# EAGLE design parksharks_board (EAGLE 9.6.2)
CNAME: MSP430FR5994 Sensor Board; CREVISION: 1; DESIGNER: Jacob Sorber
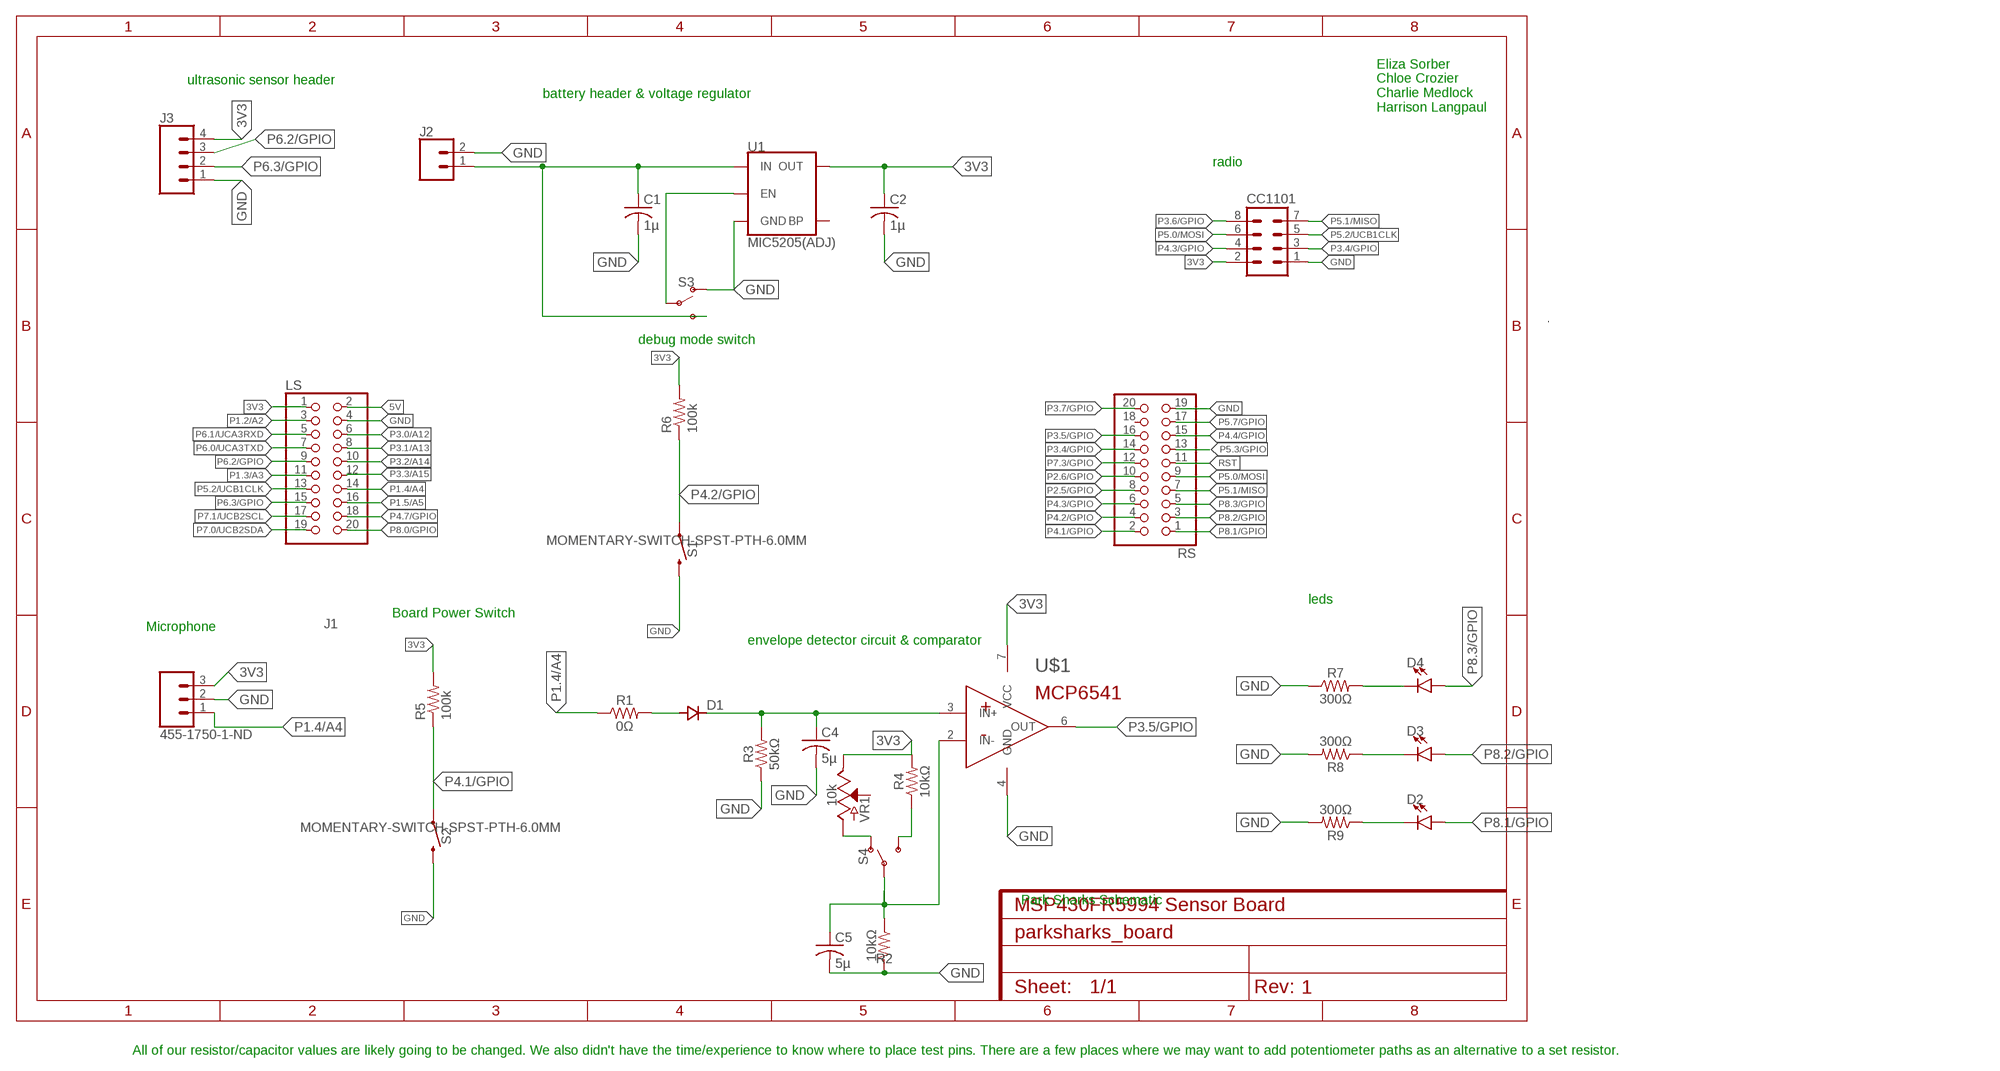
[diagram p0: schematic, sheet 1]

## Parts
C1  1µ  C-USC0805  [C0805]
C2  1µ  C-USC0805  [C0805]
C4  5µ  C-USC0805  [C0805]
C5  5µ  C-USC0805  [C0805]
CC1101  MA04-2  [MA04-2]
D1  DSOD323  [SOD323]
D2  LED5MM  [LED_5MM]
D3  LED5MM  [LED_5MM]
D4  LED5MM  [LED_5MM]
J1  455-1750-1-ND  CONN_03  [1X03]
J2  CONN_02  [1X02]
J3  CONN_04JST-PTH  [JST-4-PTH]
LS  PINHD-2X10  [2X10]
R1  0Ω  0.3OHM-0805-1/8W-1%  [0805]
R2  10kΩ  0.3OHM-0805-1/8W-1%  [0805]
R3  50kΩ  0.3OHM-0805-1/8W-1%  [0805]
R4  10kΩ  0.3OHM-0805-1/8W-1%  [0805]
R5  100k  R-US_R0805  [R0805]
R6  100k  R-US_R0805  [R0805]
R7  300Ω  0.3OHM-0805-1/8W-1%  [0805]
R8  300Ω  0.3OHM-0805-1/8W-1%  [0805]
R9  300Ω  0.3OHM-0805-1/8W-1%  [0805]
RS  PINHD-2X10  [2X10]
S1  MOMENTARY-SWITCH-SPST-PTH-6.0MM  [TACTILE_SWITCH_PTH_6.0MM]
S2  MOMENTARY-SWITCH-SPST-PTH-6.0MM  [TACTILE_SWITCH_PTH_6.0MM]
S3  SWITCH-SPDT-PTH-11.6X4.0MM  [SWITCH_SPDT_PTH_11.6X4.0MM]
S4  SWITCH-SPDT-PTH-11.6X4.0MM  [SWITCH_SPDT_PTH_11.6X4.0MM]
U1  MIC5205(ADJ)  V_REG_MIC5205ADJ  [SOT23-5]
U$1  MCP654!  [DIP08]
VR1  10k  POTENTIOMETER-PTH-9MM-1/20W-20%  [POT-PTH-ALPS]

## Nets
3V3: C2.1 CC1101.2 J1.3 J3.4 LS.1 R4.2 R5.2 R6.2 U1.5(OUT) U$1.7(VCC) VR1.P$1(E)
5V: LS.2
GND: C1.2 C2.2 C4.2 C5.2 CC1101.1 J1.2 J2.2 J3.1 LS.4 R2.2 R3.1 R7.1 R8.2 R9.2 RS.19 S1.3 S2.3 S3.1(O) U1.2(GND) U$1.4(GND)
N$1: D1.2(A) R1.2
N$2: C4.1 D1.1(C) R3.2 U$1.3(IN+)
N$3: C5.1 R2.1 S4.2(P) U$1.2(IN-)
N$4: S3.2(P) U1.3(EN)
N$5: S4.1(O) VR1.P$3(A)
N$6: R4.1 S4.3(S)
N$7: C1.1 J2.1 S3.3(S) U1.1(IN)
N$12: D4.K(C) R7.2
N$13: D3.K(C) R8.1
N$14: D2.K(C) R9.1
P1.2/A2: LS.3
P1.3/A3: LS.11
P1.4/A4: J1.1 LS.14 R1.1
P1.5/A5: LS.16
P2.5/GPIO: RS.8
P2.6/GPIO: RS.10
P3.0/A12: LS.6
P3.1/A13: LS.8
P3.2/A14: LS.10
P3.3/A15: LS.12
P3.4/GPIO: CC1101.3 RS.14
P3.5/GPIO: RS.16 U$1.6(OUT)
P3.6/GPIO: CC1101.8
P3.7/GPIO: RS.20
P4.1/GPIO: R5.1 RS.2 S2.1
P4.2/GPIO: R6.1 RS.4 S1.1
P4.3/GPIO: CC1101.4 RS.6
P4.4/GPIO: RS.15
P4.7/GPIO: LS.18
P5.0/MOSI: CC1101.6 RS.9
P5.1/MISO: CC1101.7 RS.7
P5.2/UCB1CLK: CC1101.5 LS.13
P5.3/GPIO: RS.13
P5.7/GPIO: RS.17
P6.0/UCA3TXD: LS.7
P6.1/UCA3RXD: LS.5
P6.2/GPIO: J3.3 LS.9
P6.3/GPIO: J3.2 LS.15
P7.0/UCB2SDA: LS.19
P7.1/UCB2SCL: LS.17
P7.3/GPIO: RS.12
P8.0/GPIO: LS.20
P8.1/GPIO: D2.A RS.1
P8.2/GPIO: D3.A RS.3
P8.3/GPIO: D4.A RS.5
RST: RS.11
Unconnected: RS.18 U1.4(BP) VR1.P$2(S)

## Notes on the sheet
- ultrasonic sensor header
- battery header & voltage regulator
- Eliza Sorber
  Chloe Crozier
  Charlie Medlock
  Harrison Langpaul
- radio
- debug mode switch
- leds
- Board Power Switch
- Microphone
- envelope detector circuit & comparator
- Park Sharks Schematic
- All of our resistor/capacitor values are likely going to be changed. We also didn't have the time/experience to know where to place test pins. There are a few places where we may want to add potentiometer paths as an alternative to a set resistor.

## Library data of the parts
C1 C2 C4 C5 = rcl:C-US: CAPACITOR, American symbol; SPICEPREFIX: C
CC1101 = con-lstb:MA04-2: PIN HEADER; OC_FARNELL: unknown; OC_NEWARK: unknown
D1 = zetex:D: DIODE; MPN: CDSOD323-T05C; OC_FARNELL: 1824860; OC_NEWARK: 79R6078
D2-D4 = SparkFun-LED:LED: LED (Generic) Standard schematic elements and footprints for 5mm, 3mm, 1206, and 0603 sized LEDs. Generic LEDs with no color specified.
J1 = SparkFun-Connectors:CONN_03: Multi connection point. Often used as Generic Header-pin footprint for 0.1 inch spaced/style header connections On any of the 0.1 inch spaced packages, you can populate with these: Break Away Headers - Straight <https://www.sparkfun.com/products/116> (PRT-00116) Break Away Male Headers - Right Angle <https://www.sparkfun.com/products/553> (PRT-00553) Female Headers <https://www.sparkfun.com/products/115> (PRT-00115) Break Away Headers - Machine Pin <https://www.sparkfun.com/products/117> (PRT-00117) Break Away Female Headers - Swiss Machine Pin <https://www.sparkfun.com/products/743> (PRT-00743) Stackable Header - 3 Pin (Female, 0.1") <https://www.sparkfun.com/products/13875> (PRT-13875) For SCREWTERMINALS and SPRING TERMINALS visit here: Screw Terimnals on SparkFun.com <https://www.sparkfun.com/search/results?term=Screw+Terminals> (5mm/3.5mm/2.54mm spacing) This device is also useful as a general connection point to wire up your design to another part of your project. Our various solder wires solder well into these plated through hole pads. Hook-Up Wire - Assortment (Stranded, 22 AWG) <https://www.sparkfun.com/products/11375> (PRT-11375) Hook-Up Wire - Assortment (Solid Core, 22 AWG) <https://www.sparkfun.com/products/11367> (PRT-11367) View the entire wire category on our website here <https://www.sparkfun.com/categories/141> Special notes: Molex polarized connector foot print use with SKU : PRT-08232 with associated crimp pins and housings.; PROD_ID: XXX-00000
J2 = SparkFun-Connectors:CONN_02: Multi connection point. Often used as Generic Header-pin footprint for 0.1 inch spaced/style header connections On any of the 0.1 inch spaced packages, you can populate with these: Break Away Headers - Straight <https://www.sparkfun.com/products/116> (PRT-00116) Break Away Male Headers - Right Angle <https://www.sparkfun.com/products/553> (PRT-00553) Female Headers <https://www.sparkfun.com/products/115> (PRT-00115) Break Away Headers - Machine Pin <https://www.sparkfun.com/products/117> (PRT-00117) Break Away Female Headers - Swiss Machine Pin <https://www.sparkfun.com/products/743> (PRT-00743) For SCREWTERMINALS and SPRING TERMINALS visit here: Screw Terimnals on SparkFun.com <https://www.sparkfun.com/search/results?term=Screw+Terminals> (5mm/3.5mm/2.54mm spacing) This device is also useful as a general connection point to wire up your design to another part of your project. Our various solder wires solder well into these plated through hole pads. Hook-Up Wire - Assortment (Stranded, 22 AWG) <https://www.sparkfun.com/products/11375> (PRT-11375) Hook-Up Wire - Assortment (Solid Core, 22 AWG) <https://www.sparkfun.com/products/11367> (PRT-11367) View the entire wire category on our website here <https://www.sparkfun.com/categories/141> Special notes: Molex polarized connector foot print use with: PRT-08233 with associated crimp pins and housings. 2.54_SCREWTERM for use with PRT-10571. 3.5mm Screw Terminal footprints for PRT-08084 5mm Screw Terminal footprints for use with PRT-08432
J3 = SparkFun-Connectors:CONN_04: Multi connection point. Often used as Generic Header-pin footprint for 0.1 inch spaced/style header connections On any of the 0.1 inch spaced packages, you can populate with these: Break Away Headers - Straight <https://www.sparkfun.com/products/116> (PRT-00116) Break Away Male Headers - Right Angle <https://www.sparkfun.com/products/553> (PRT-00553) Female Headers <https://www.sparkfun.com/products/115> (PRT-00115) Break Away Headers - Machine Pin <https://www.sparkfun.com/products/117> (PRT-00117) Break Away Female Headers - Swiss Machine Pin <https://www.sparkfun.com/products/743> (PRT-00743) For SCREWTERMINALS and SPRING TERMINALS visit here: Screw Terimnals on SparkFun.com <https://www.sparkfun.com/search/results?term=Screw+Terminals> (5mm/3.5mm/2.54mm spacing) This device is also useful as a general connection point to wire up your design to another part of your project. Our various solder wires solder well into these plated through hole pads. Hook-Up Wire - Assortment (Stranded, 22 AWG) <https://www.sparkfun.com/products/11375> (PRT-11375) Hook-Up Wire - Assortment (Solid Core, 22 AWG) <https://www.sparkfun.com/products/11367> (PRT-11367) View the entire wire category on our website here <https://www.sparkfun.com/categories/141> Special notes: Molex polarized connector foot print use with SKU : PRT-08231 with associated crimp pins and housings. 1MM SMD Version SKU: PRT-10208; PROD_ID: WIRE-13531; SF_ID: PRT-09916
LS RS = pinhead:PINHD-2X10: PIN HEADER
R1-R4 R7-R9 = SparkFun-Resistors:0.3OHM: 0.3Ω resistor A resistor is a passive two-terminal electrical component that implements electrical resistance as a circuit element. Resistors act to reduce current flow, and, at the same time, act to lower voltage levels within circuits. - Wikipedia; PROD_ID: RES-11622; VALUE: 0.3
R5 R6 = rcl:R-US_: RESISTOR, American symbol; SPICEPREFIX: R
S1 S2 = SparkFun-Switches:MOMENTARY-SWITCH-SPST: Momentary Switch (Pushbutton) - SPST Normally-open (NO) SPST momentary switches (buttons, pushbuttons). Variants PTH-12MM - 12mm square, through-hole Momentary Pushbutton Switch - 12mm Square <https://www.sparkfun.com/products/9190> (COM-09190) PTH-6.0MM, PTH-6.0MM-KIT - 6.0mm square, through-hole Mini Pushbutton Switch <https://www.sparkfun.com/products/97> (COM-00097) KIT package intended for soldering kit's - only one side of pads' copper is exposed. PTH-RIGHT-ANGLE-KIT - Right-angle, through-hole Right Angle Tactile Button <https://www.sparkfun.com/products/10791> - Used on SparkFun BigTime Watch Kit <https://www.sparkfun.com/products/11734> SMD-12MM - 12mm square, surface-mount Tactile Button - SMD (12mm) <https://www.sparkfun.com/products/12993> (COM-12993) Used on SparkFun PicoBoard <https://www.sparkfun.com/products/11888> SMD-4.5MM - 4.5mm Square Trackball Switch Used on SparkFun Blackberry Trackballer Breakout <https://www.sparkfun.com/products/13169> SMD-4.6MMX2.8MM - 4.60mm x 2.80mm, surface mount Used on SparkFun Pro Micro - RP2040 <https://www.sparkfun.com/products/17717> SMD-5.2MM, SMD-5.2-REDUNDANT - 5.2mm square, surface-mount Mini Pushbutton Switch - SMD <https://www.sparkfun.com/products/8720> (COM-08720) Used on Arduino Pro Mini <https://www.sparkfun.com/products/11114> REDUNDANT package connects both switch circuits together SMD-6.0X3.5MM - 6.0 x 3.5mm, surface mount Momentary Reset Switch SMD <https://www.sparkfun.com/products/8229> (COM-08229) SMD-6.2MM-TALL - 6.2mm square, surface mount Tactile Button - SMD (6mm) <https://www.sparkfun.com/products/12992> Used on SparkFun Digital Sandbox <https://www.sparkfun.com/products/12651> SMD-RIGHT-ANGLE - Right-angle, surface mount Used on SparkFun Block for Intel® Edison - Arduino <https://www.sparkfun.com/products/13036>; PROD_ID: SWCH-08441; SF_SKU: COM-00097
S3 S4 = SparkFun-Switches:SWITCH-SPDT: Single Pole, Double Throw (SPDT) Switch Single-pole, double-throw (SPDT) switch. Variant Overview SMD-AYZ0202 Surface Mount DPDT Switch <https://www.sparkfun.com/products/597> (COM-00597) Used on e.g. LilyPad Arduino USB - ATmega32U4 Board <https://www.sparkfun.com/products/12049> PTH-11.6X4.0MM SPDT Mini Power Switch <https://www.sparkfun.com/products/102> (COM-00102) Used on e.g. SparkFun Simon Says - Through-Hole Soldering Kit <https://www.sparkfun.com/products/10547> (KIT-10547) PTH-11.6X4.0MM-KIT KIT version of SPDT Mini Power Switch - Simplifies soldering by removing tStop of switch pins - only one side can be soldered. PTH-11.6X4.0MM-LOCK LOCK version of SPDT Mini Power Switch - Offset pins hold switch in place for easier soldering. SMD-RIGHT-ANGLE Surface Mount Right Angle Switch <https://www.sparkfun.com/products/10860> (COM-10860) Used on e.g. SparkFun ESP8266 Thing <https://www.sparkfun.com/products/13231>; PROD_ID: SWCH-08261; SF_SKU: COM-00102
U1 = SparkFun-IC-Power:V_REG_MIC5205: V_REG MIC5205 Standard 3.3V, 5V, and Adjustable 150mA LDO voltage regulator in SOT-23 layout. Micrel part MIC5205. BP (by-pass) pin is used to lower output noise with 470pF cap, may be left open. On the adjustable version BP is used to set output.; PROD_ID: VREG-12594
U$1 = SparkFun-IC-Amplifiers:MCP654!
VR1 = SparkFun-Resistors:POTENTIOMETER: Potentiometer (Pot) Three-terminal potentiometers, with an adjustable wiper and two adjustable resistors. A pot can be used to create a configurable voltage divider, or as a variable resistor. Variants ALPS_POT and ALPS_POT_KIT - PTH, breadboard compatible, 9mm square pots Rotary Potentiometer - Linear (10k ohm) <https://www.sparkfun.com/products/9288> (COM-09288) The KIT variant exposes copper on only one side of the PTH pad, so the part can only be assembled on one side of the PCB. Useful for beginner soldering kits.; PROD_ID: RES-09177; SF_SKU: COM-09288

## Board
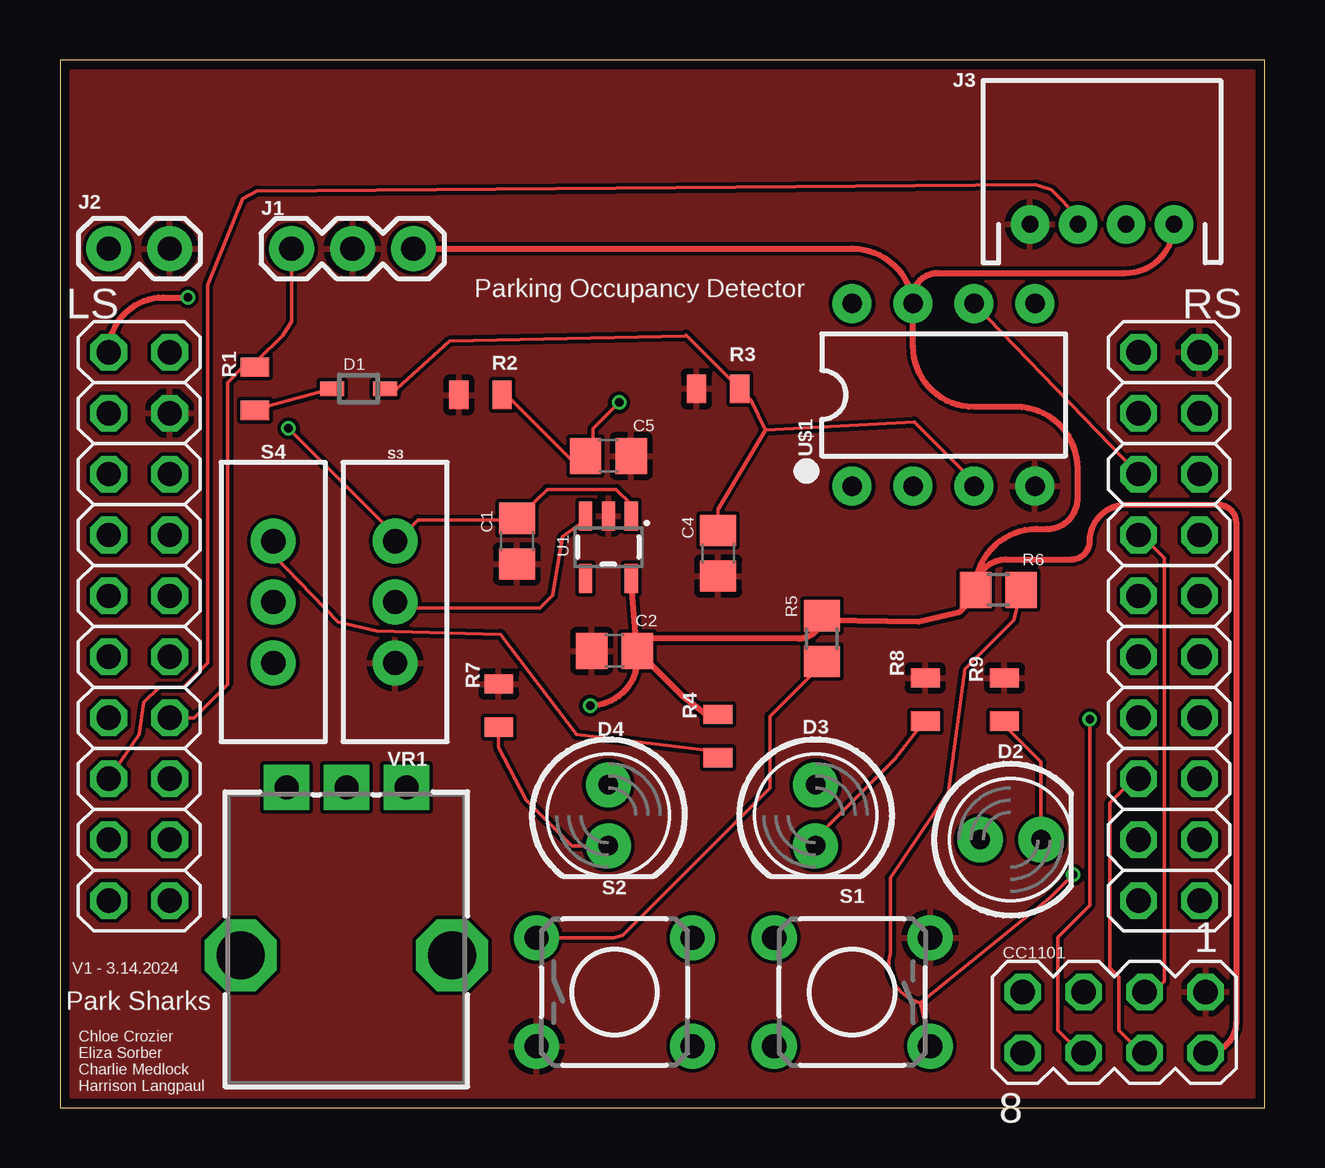
[diagram p1: board, top side]
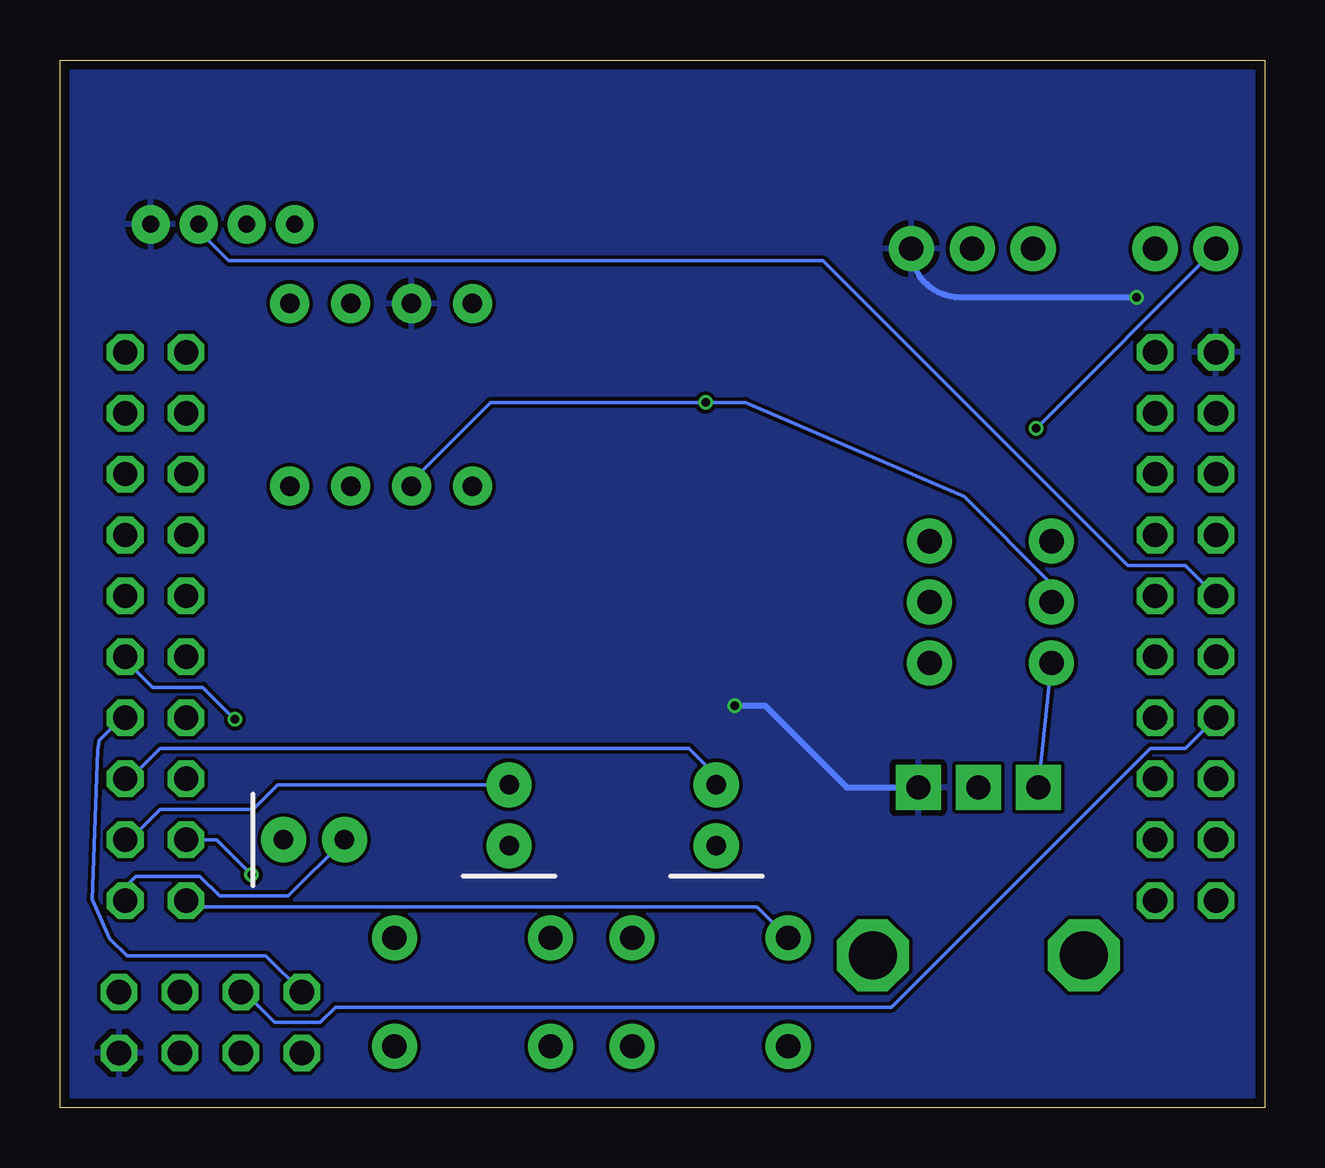
[diagram p2: board, bottom side, seen from below]

Size 50.22 x 43.68 mm. Coordinates in mm from the lower left corner, seen from the top.
Outline: 0,0 50.22,0 50.22,43.68 0,43.68 0,0
Copper layers (1*16): Top 0.035559375mm / dielectric 1.6mm / Bottom 0.035559375mm
Design rules "oshpark-2layer": minimum track width 6mil, minimum drill 10mil, track to track 6mil, track to pad 6mil, pad to pad 6mil, via to via 6mil, smd to smd 6mil, copper to edge 15mil, drill to drill 6mil, minimum pad ring 5mil, minimum via ring 5mil, stop-mask expansion 2.5mil, vias tented up to drill 0mil, thermal gap 10mil

### Footprints (pad centres in the part's own frame; a part is rotated, then mirrored left to right if it is on the bottom)
C0805 = smd 1.3 x 1.5: 1 -0.95,0; 2 0.95,0
MA04-2 = drill 1.016 octagon: 1 -3.81,-1.27; 2 -3.81,1.27; 3 -1.27,-1.27; 4 -1.27,1.27; 5 1.27,-1.27; 6 1.27,1.27; 7 3.81,-1.27; 8 3.81,1.27
SOD323 = smd 1 x 0.6: 1 -1.1,0; 2 1.1,0
LED_5MM = drill 0.813 pad 1.88: A -1.27,0; K 1.27,0
1X03 = drill 1.016 pad 1.88: 1 0,0; 2 2.54,0; 3 5.08,0
1X02 = drill 1.016 pad 1.88: 1 0,0; 2 2.54,0
JST-4-PTH = drill 0.7 pad 1.6: 1 -3,0; 2 -1,0; 3 1,0; 4 3,0
2X10 = drill 1.016 octagon: 1 -11.43,-1.27; 2 -11.43,1.27; 3 -8.89,-1.27; 4 -8.89,1.27; 5 -6.35,-1.27; 6 -6.35,1.27; 7 -3.81,-1.27; 8 -3.81,1.27; 9 -1.27,-1.27; 10 -1.27,1.27; 11 1.27,-1.27; 12 1.27,1.27; 13 3.81,-1.27; 14 3.81,1.27; 15 6.35,-1.27; 16 6.35,1.27; 17 8.89,-1.27; 18 8.89,1.27; 19 11.43,-1.27; 20 11.43,1.27
0805 = smd 0.8 x 1.2: 1 -0.9,0; 2 0.9,0
R0805 = smd 1.3 x 1.5: 1 -0.95,0; 2 0.95,0
TACTILE_SWITCH_PTH_6.0MM = drill 1.016 pad 1.88: 1 -3.251,2.261; 2 3.251,2.261; 3 -3.251,-2.261; 4 3.251,-2.261
SWITCH_SPDT_PTH_11.6X4.0MM = drill 1.016 pad 1.88: 1 0,2.54; 2 0,0; 3 0,-2.54
SOT23-5 = smd 0.55 x 1.2: 1 -0.95,-1.3; 2 0,-1.3; 3 0.95,-1.3; 4 0.95,1.3; 5 -0.95,1.3
DIP08 = drill 0.813 pad 1.626: 1 -3.81,-3.81; 2 -1.27,-3.81; 3 1.27,-3.81; 4 3.81,-3.81; 5 3.81,3.81; 6 1.27,3.81; 7 -1.27,3.81; 8 -3.81,3.81
POT-PTH-ALPS = drill 1 pad 1.88 square: P$1 7,-2.5; P$2 7,0; P$3 7,2.5 | drill 2 octagon: P$4 0,-4.4; P$5 0,4.4

### Placement (x,y rotation side)
C1  19.05,23.62 270 top
C2  23.11,19.05 180 top
C4  27.43,23.11 270 top
C5  22.86,27.18 0 top
CC1101  43.94,3.56 180 top
D1  12.45,29.97 180 top
D2  39.62,11.18 0 top
D3  31.5,12.19 270 top
D4  22.86,12.19 270 top
J1  9.65,35.81 0 top
J2  2.03,35.81 0 top
J3  43.43,36.83 0 top
LS  3.3,20.07 270 top
R1  8.13,29.97 270 top
R2  17.53,29.72 180 top
R3  27.43,29.97 0 top
R4  27.43,15.49 90 top
R5  31.75,19.56 90 top
R6  39.12,21.59 180 top
R7  18.29,16.76 270 top
R8  36.07,17.02 90 top
R9  39.37,17.02 90 top
RS  46.23,20.07 90 top
S1  33.02,4.83 180 top
S2  23.11,4.83 0 top
S3  13.97,21.08 180 top
S4  8.89,21.08 180 top
U1  22.86,23.37 180 top
U$1  36.83,29.72 0 top
VR1  11.94,6.35 90 top

### Tracks (layer width: path | path; a pad name or v marks a point on that pad's centre or on a via)
3V3  (via drill 0.35)
  Top 0.152: R6.2 38.17,21.34 | 31.94,20.32 R5.2 | 35.56,33.27 U$1.7 35.56,33.78 | C2.1 24.06,18.8 | 24.57,19.56 C2.1 | 26.92,16.39 R4.2 | C2.1 24.06,18.73
  Top 0.254: 38.17,21.34 37.48,20.65 35.78,20.25 31.94,20.32 | 35.56,33.78 arc-90 36.58,34.8 44.4,34.8 arc90 J3.4 | CC1101.2 arc90 49.02,3.56 49.02,24.38 arc90 48.26,25.15 44.45,25.15 arc90 42.93,23.62 arc-90 42.16,22.86 39.44,22.86 arc90 R6.2 arc-90 40.71,24.13 41.15,24.13 arc90 42.42,25.4 42.42,26.67 arc90 39.88,29.21 38.1,29.21 arc-90 35.56,31.75 35.56,33.27 arc90 33.02,35.81 J1.3 | LS.1 arc-90 4.32,33.78 v5.33,33.78 | R5.2 arc-90 30.8,19.56 24.57,19.56 | C2.1 25.96,17.16 26.92,16.39 | 24.06,18.8 U1.5 | 24.06,18.73 arc-90 v22.1,16.76
  Bottom 0.254: v22.1,16.76 20.83,16.76 17.41,13.35 VR1.P$1 | v5.33,33.78 12.7,33.78 arc90 J1.3
  pour Bottom: -5.33,50.29 56.13,50.29 56.13,-5.08 -5.33,-5.08
GND
  pour Top: -2.54,45.97 53.09,45.97 53.09,-1.52 -2.54,-1.52
N$1
  Top 0.152: D1.2 8.51,29.2 8.15,29.1 R1.2
N$2
  Top 0.152: D1.1 14.05,29.97 16.24,31.95 26.03,32.17 26.09,32.21 R3.2 28.81,29.5 29.4,28.26 | C4.1 27.43,24.93 29.4,28.26 | 29.4,28.26 35.61,28.59 38.1,26.1 U$1.3
N$3  (via drill 0.35)
  Top 0.152: R2.1 18.73,29.59 21.27,27.05 21.91,27.05 C5.1 22.23,27.37 22.23,28.32 v23.3,29.4
  Bottom 0.152: U$1.2 35.56,26.1 32.26,29.4 v23.3,29.4 21.65,29.4 12.52,25.47 8.89,21.84 S4.2
N$4
  Top 0.152: S3.2 14.22,20.83 20,20.83 20.53,21.36 20.95,23.81 21.91,24.51 U1.3
N$5
  Bottom 0.152: S4.1 VR1.P$3
N$6
  Top 0.152: R4.1 26.87,14.92 21.53,15.56 18.36,19.73 13.21,19.88 11.6,20.26 8.89,23.07 S4.3
N$7  (via drill 0.35)
  Top 0.152: U1.1 23.81,25.15 23.18,25.78 20.32,25.78 C1.1 19.05,24.51 14.92,24.51 13.97,23.56 S3.3 13.97,23.88 v9.53,28.32
  Bottom 0.152: v9.53,28.32 J2.1
N$12
  Top 0.152: D4.K 21.34,10.92 19.43,12.83 18.29,15.01 R7.2
N$13
  Top 0.152: R8.1 35.88,15.94 34.8,14.54 31.75,11.49 31.75,11.18 D3.K
N$14
  Top 0.152: D2.K 40.89,14.41 39.37,15.94 R9.1
P1.4/A4
  Top 0.152: J1.1 9.65,32.77 9.27,32.2 8.26,31.18 R1.1 7.62,30.87 6.99,30.24 6.99,17.65 5.59,16.26 LS.14
P3.4/GPIO
  Top 0.152: CC1101.3 45.59,4.83 46.04,5.27 46.04,22.92 45.09,23.88 RS.14
P3.5/GPIO
  Top 0.152: U$1.6 RS.16
P4.1/GPIO
  Top 0.152: R5.1 31.75,18.48 29.59,16.32 29.59,13.33 23.45,7.19 23.08,7.09 S2.1
  Bottom 0.152: RS.2 44.7,8.38 21.21,8.38 21.18,8.36 21.13,8.36 S2.1
P4.2/GPIO  (via drill 0.35)
  Top 0.152: R6.1 39.76,20.33 37.72,18.29 37.02,13.17 34.61,9.59 34.61,6.44 arc90 35.87,4.37 | 35.87,4.37 S1.1 | v42.23,9.71 41.26,8.75 35.87,4.37
  Bottom 0.152: RS.4 43.69,11.18 v42.23,9.71
P4.3/GPIO
  Top 0.152: RS.6 44.77,13.72 43.75,12.7 43.75,5.84 44.13,5.46 44.13,3.24 45.09,2.29 CC1101.4
P5.0/MOSI  (via drill 0.35)
  Top 0.152: v42.93,16.19 42.93,8.45 41.59,7.11 41.59,3.24 42.55,2.29 CC1101.6
  Bottom 0.152: v42.93,16.19 44.26,17.53 46.35,17.53 47.62,18.8 RS.9
P5.1/MISO
  Bottom 0.152: CC1101.7 41.64,6.33 47.41,6.33 48.13,7.05 48.88,8.68 48.64,14.92 48.58,15.3 47.62,16.26 RS.7
P5.2/UCB1CLK
  Bottom 0.152: LS.13 3.3,14.99 4.76,14.99 15.56,4.19 38.73,4.19 39.37,3.56 41.27,3.56 42.55,4.83 CC1101.5
P6.2/GPIO
  Bottom 0.152: LS.9 3.3,22.61 5.71,22.61 18.41,35.31 43.18,35.31 44.45,36.58 J3.3
P6.3/GPIO
  Top 0.152: LS.15 3.3,15.56 3.49,16.89 4.13,17.53 5.14,17.53 6.16,18.54 6.16,34.3 7.61,37.89 8.21,38.22 40.65,38.47 41.32,38.27 42.43,37.15 J3.2
P8.1/GPIO
  Bottom 0.152: RS.1 47.5,9.21 47.05,9.65 44.39,9.65 43.56,8.83 40.7,8.83 D2.A
P8.2/GPIO
  Bottom 0.152: D3.A 41.15,13.46 42.16,12.45 46.04,12.45 47.31,11.18 RS.3
P8.3/GPIO
  Bottom 0.152: D4.A 22.86,13.84 24,14.99 46.04,14.99 47.31,13.72 RS.5

### Text on the board
tPlace: Parking Occupancy Detector | V1 - 3.14.2024 | Park Sharks | Chloe Crozier / Eliza Sorber / Charlie Medlock / Harrison Langpaul